# Altium schematic sheet coil_inj_drivers.SchDoc
size A; SheetNumber: 2; SheetTotal: 5
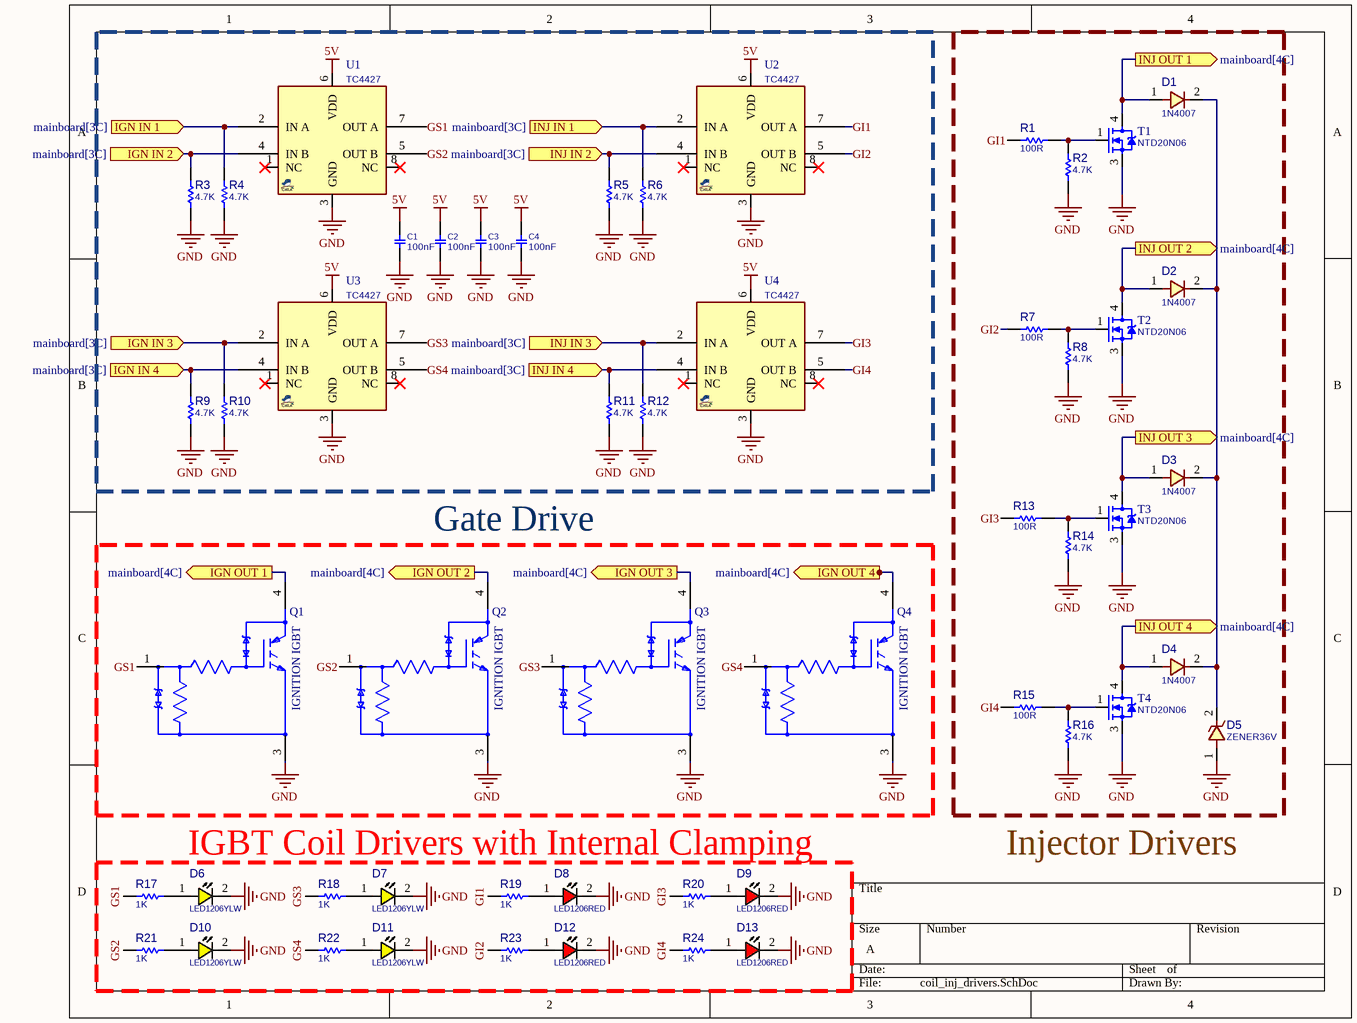
[diagram p0: coil_inj_drivers.SchDoc]

## Parts
C1  100nF  [C1206]
C2  100nF  [C1206]
C3  100nF  [C1206]
C4  100nF  [C1206]
D1  1N4007  [D_SMA]
D2  1N4007  [D_SMA]
D3  1N4007  [D_SMA]
D4  1N4007  [D_SMA]
D5  ZENER36V  [D_SMB]
D6  LED1206YLW  [LED1206YLW]
D7  LED1206YLW  [LED1206YLW]
D8  LED1206RED  [LED1206RED]
D9  LED1206RED  [LED1206RED]
D10  LED1206YLW  [LED1206YLW]
D11  LED1206YLW  [LED1206YLW]
D12  LED1206RED  [LED1206RED]
D13  LED1206RED  [LED1206RED]
Q1  IGNITION IGBT  [FP-369AS-MFG]
Q2  IGNITION IGBT  [FP-369AS-MFG]
Q3  IGNITION IGBT  [FP-369AS-MFG]
Q4  IGNITION IGBT  [FP-369AS-MFG]
R1  100R  [R1206]
R2  4.7K  [R1206]
R3  4.7K  [R1206]
R4  4.7K  [R1206]
R5  4.7K  [R1206]
R6  4.7K  [R1206]
R7  100R  [R1206]
R8  4.7K  [R1206]
R9  4.7K  [R1206]
R10  4.7K  [R1206]
R11  4.7K  [R1206]
R12  4.7K  [R1206]
R13  100R  [R1206]
R14  4.7K  [R1206]
R15  100R  [R1206]
R16  4.7K  [R1206]
R17  1K  [R1206]
R18  1K  [R1206]
R19  1K  [R1206]
R20  1K  [R1206]
R21  1K  [R1206]
R22  1K  [R1206]
R23  1K  [R1206]
R24  1K  [R1206]
T1  NTD20N06  [DPAK_3]
T2  NTD20N06  [DPAK_3]
T3  NTD20N06  [DPAK_3]
T4  NTD20N06  [DPAK_3]
U1  TC4427  [SO_8]
U2  TC4427  [SO_8]
U3  TC4427  [SO_8]
U4  TC4427  [SO_8]

## Ports
IGN IN 1 (in, see mainboard[3C]), IGN IN 2 (in, see mainboard[3C]), IGN IN 3 (in, see mainboard[3C]), IGN IN 4 (in, see mainboard[3C]), IGN OUT 1 (out, see mainboard[4C]), IGN OUT 2 (out, see mainboard[4C]), IGN OUT 3 (out, see mainboard[4C]), IGN OUT 4 (out, see mainboard[4C]), INJ IN 1 (in, see mainboard[3C]), INJ IN 2 (in, see mainboard[3C]), INJ IN 3 (in, see mainboard[3C]), INJ IN 4 (in, see mainboard[3C]), INJ OUT 1 (out, see mainboard[4C]), INJ OUT 2 (out, see mainboard[4C]), INJ OUT 3 (out, see mainboard[4C]), INJ OUT 4 (out, see mainboard[4C])

## Nets
5V: C1.2 C2.2 C3.2 C4.2 U1.6(VDD) U2.6(VDD) U3.6(VDD) U4.6(VDD)
GND: C1.1 C2.1 C3.1 C4.1 D5.1 D6.2(CATHODE) D7.2(CATHODE) D8.2(CATHODE) D9.2(CATHODE) D10.2(CATHODE) D11.2(CATHODE) D12.2(CATHODE) D13.2(CATHODE) Q1.3(E) Q2.3(E) Q3.3(E) Q4.3(E) R2.1 R3.1 R4.1 R5.1 R6.1 R8.1 R9.1 R10.1 R11.1 R12.1 R14.1 R16.1 T1.3(S) T2.3(S) T3.3(S) T4.3(S) U1.3(GND) U2.3(GND) U3.3(GND) U4.3(GND)
GI1: R1.2 R19.2 U2.7(OUT_A)
GI2: R7.2 R23.2 U2.5(OUT_B)
GI3: R13.2 R20.2 U4.7(OUT_A)
GI4: R15.2 R24.2 U4.5(OUT_B)
GS1: Q1.1(G) R17.2 U1.7(OUT_A)
GS2: Q2.1(G) R21.2 U1.5(OUT_B)
GS3: Q3.1(G) R18.2 U3.7(OUT_A)
GS4: Q4.1(G) R22.2 U3.5(OUT_B)
IGN IN 1: R4.2 U1.2(IN_A) ; port IGN IN 1
IGN IN 2: R3.2 U1.4(IN_B) ; port IGN IN 2
IGN IN 3: R10.2 U3.2(IN_A) ; port IGN IN 3
IGN IN 4: R9.2 U3.4(IN_B) ; port IGN IN 4
IGN OUT 1: Q1.4(C) ; port IGN OUT 1
IGN OUT 2: Q2.4(C) ; port IGN OUT 2
IGN OUT 3: Q3.4(C) ; port IGN OUT 3
IGN OUT 4: Q4.4(C) ; port IGN OUT 4
INJ IN 1: R6.2 U2.2(IN_A) ; port INJ IN 1
INJ IN 2: R5.2 U2.4(IN_B) ; port INJ IN 2
INJ IN 3: R12.2 U4.2(IN_A) ; port INJ IN 3
INJ IN 4: R11.2 U4.4(IN_B) ; port INJ IN 4
INJ OUT 1: D1.1 T1.4(D) ; port INJ OUT 1
INJ OUT 2: D1.2 D2.1 D2.2 D3.1 D3.2 D4.1 D4.2 D5.2 T2.4(D) T3.4(D) T4.4(D) ; port INJ OUT 4, port INJ OUT 3, port INJ OUT 2
NetD6_1: D6.1(ANODE) R17.1
NetD7_1: D7.1(ANODE) R18.1
NetD8_1: D8.1(ANODE) R19.1
NetD9_1: D9.1(ANODE) R20.1
NetD10_1: D10.1(ANODE) R21.1
NetD11_1: D11.1(ANODE) R22.1
NetD12_1: D12.1(ANODE) R23.1
NetD13_1: D13.1(ANODE) R24.1
NetR1_1: R1.1 R2.2 T1.1(G)
NetR7_1: R7.1 R8.2 T2.1(G)
NetR13_1: R13.1 R14.2 T3.1(G)
NetR15_1: R15.1 R16.2 T4.1(G)

Not connected (* = marked no-connect by the designer): U1 1(NC)* 8(NC)*; U2 1(NC)* 8(NC)*; U3 1(NC)* 8(NC)*; U4 1(NC)* 8(NC)*

## Notes on the sheet
- Gate Drive
- IGBT Coil Drivers with Internal Clamping
- Injector Drivers

## Library data of the parts
C1-C4 = CAP_SMD_MLCC: CAP, MLCC; PARAM: C0G, 10%; DESC: CAP, MLCC, 1nF, 50V, C0G, 10%, 0402; MANF_P#: MANF_PART#; MANF: Murata; PARAM2: 50V; PRICE: 100= 1$; ASSEMBLY: ASSEMBLY; VALUE: 100nF
D1-D4 = DIODE_SMD_1N4007: DIODE, GENERAL PURPOSE, 1000V/1A; MANF: Kingtronics; DESC: DESCRIPTION; PARAM: 1000V VRRM; PARAM2: 1A; MANF_P#: M7; ASSEMBLY: ASSEMBLY; PRICE: PRICE; VALUE: 1N4007
D5 = DIODE_SMD_ZENER_Z2SMB36: DIODE, ZENER, 2W, 36V; MANF: Diotec; DESC: DESCRIPTION; PARAM: 2W, 16Ohm, -50~150°C; ASSEMBLY: ASSEMBLY; PRICE: -; PARAM2: 36V; MANF_P#: Z2SMB36; VALUE: ZENER36V
D6 D7 D10 D11 = LED_SMD_1206_YLW: LED, SMD, 1206, YELLOW; DESC: DESCRIPTION; MANF_P#: MANF_PART#; PARAM2: 2.2V; MANF: MANF; ASSEMBLY: ASSEMBLY; PRICE: 36t@Javan; VALUE: LED1206YLW
D8 D9 D12 D13 = LED_SMD_1206_RED: LED, SMD, 1206, RED; DESC: DESCRIPTION; MANF_P#: MANF_PART#; PARAM2: 2.2V; MANF: MANF; ASSEMBLY: ASSEMBLY; PRICE: 36t@Javan; VALUE: LED1206RED
Q1-Q4 = IGNITION IGBT: NexarPartId: 87655026; Collector Emitter Saturation Voltage: 1.15V; Collector Emitter Voltage (VCEO): 1.5V; Max Collector Current: 41A; Element Configuration: Single; Max Breakdown Voltage: 400V; Max Power Dissipation: 150W; Radiation Hardening: No; RoHS: Compliant; Schedule B: 8541290080, 8541290080|8541290080, 8541290080|8541290080|8541290080, 8541290080|8541290080|8541290080|8541290080; Number of Pins: 3; Max Operating Temperature: 175°C; Mount: Surface Mount; Case/Package: DPAK; Min Operating Temperature: -55°C; Clamping Voltage: 400V; Weight: 260.37mg; Collector Emitter Breakdown Voltage: 400V
R1-R24 = RES_SMD_1206: RESISTOR, SMD; PARAM: 1%, 0.25W; DESC: DESCRIPTION; DIST#: MOUSER; MANF_P#: -; MANF: -; ASSEMBLY: ASSEMBLY; PRICE: -; PARAM2: -
  R1 R7 R13 R15: VALUE: 100R
  R2-R6 R8-R12 R14 R16: VALUE: 4.7K
  R17-R24: VALUE: 1K
T1-T4 = MOSN_NTD20N06_DPAK: MOSFET, N-CH, 60V, 20A, 39mRDS, 1~2VGSth; MANF_P#: NTD20N06L; PARAM2: 60VDS, 1~2VGSth; PARAM: 20A, 39mRDS, Cin700pF, -55~150oC; MANF: ON; ASSEMBLY: ASSEMBLY; PRICE: 0.9$; VALUE: NTD20N06
U1-U4 = MOS_DUAL_TC4427: power Mosfet Driver, Dual, High-Speed, 1.5A; ASSEMBLY: ASSEMBLY; MANF_P#: TC4427; VALUE: TC4427